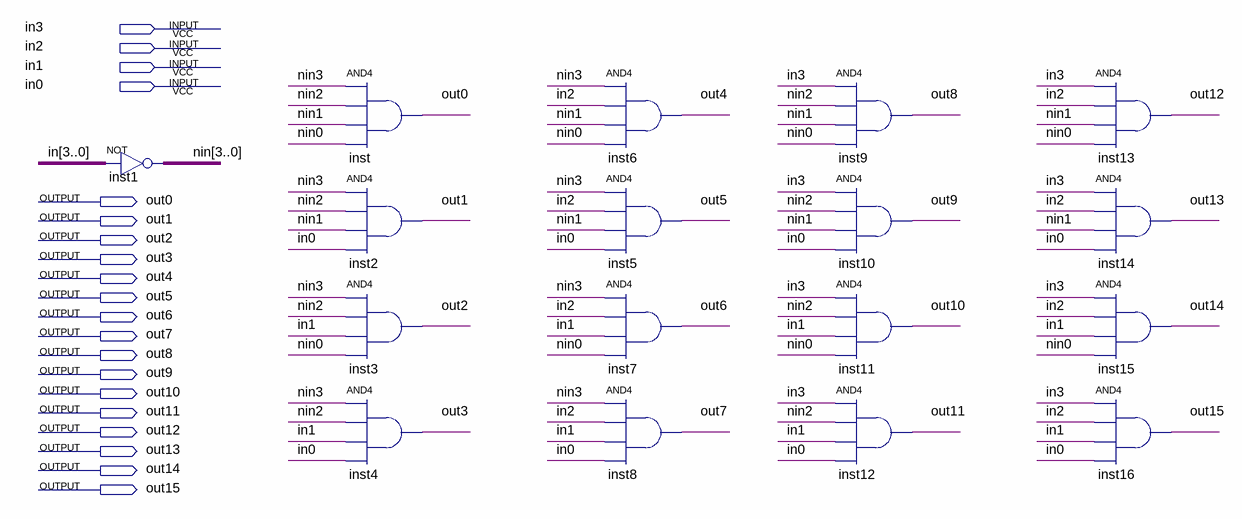
[diagram p0: schematic sheet]
// Quartus schematic pfs_decod4x16.bdf as structural Verilog: 17 symbols, 20 pins
module pfs_decod4x16 (
  input  in3,
  input  in2,
  input  in1,
  input  in0,
  output out0,
  output out1,
  output out2,
  output out3,
  output out4,
  output out5,
  output out6,
  output out7,
  output out8,
  output out9,
  output out10,
  output out11,
  output out12,
  output out13,
  output out14,
  output out15
);

  wire [3:0] nin;

  assign nin = ~{in3, in2, in1, in0};  // NOT inst1, 4 bits wide
  and inst (out0, nin[3], nin[2], nin[1], nin[0]);
  and inst2 (out1, nin[3], nin[2], nin[1], in0);
  and inst3 (out2, nin[3], nin[2], in1, nin[0]);
  and inst4 (out3, nin[3], nin[2], in1, in0);
  and inst6 (out4, nin[3], in2, nin[1], nin[0]);
  and inst5 (out5, nin[3], in2, nin[1], in0);
  and inst7 (out6, nin[3], in2, in1, nin[0]);
  and inst8 (out7, nin[3], in2, in1, in0);
  and inst9 (out8, in3, nin[2], nin[1], nin[0]);
  and inst10 (out9, in3, nin[2], nin[1], in0);
  and inst11 (out10, in3, nin[2], in1, nin[0]);
  and inst12 (out11, in3, nin[2], in1, in0);
  and inst13 (out12, in3, in2, nin[1], nin[0]);
  and inst14 (out13, in3, in2, nin[1], in0);
  and inst15 (out14, in3, in2, in1, nin[0]);
  and inst16 (out15, in3, in2, in1, in0);
endmodule
